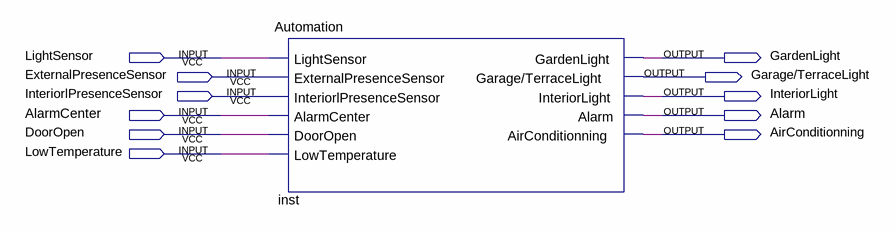
[diagram p0: schematic sheet]
// Quartus schematic Home_automation.bdf as structural Verilog: 1 symbols, 11 pins
module Home_automation (
  input  LightSensor,
  input  ExternalPresenceSensor,
  input  InteriorlPresenceSensor,
  input  AlarmCenter,
  input  DoorOpen,
  input  LowTemperature,
  output GardenLight,
  output \Garage/TerraceLight ,
  output InteriorLight,
  output Alarm,
  output AirConditionning
);

  Automation inst (
    .LightSensor(LightSensor), .ExternalPresenceSensor(ExternalPresenceSensor),
    .InteriorlPresenceSensor(InteriorlPresenceSensor), .AlarmCenter(AlarmCenter), .DoorOpen(DoorOpen),
    .LowTemperature(LowTemperature), .GardenLight(GardenLight),
    .\Garage/TerraceLight (\Garage/TerraceLight ), .InteriorLight(InteriorLight), .Alarm(Alarm),
    .AirConditionning(AirConditionning));
endmodule
